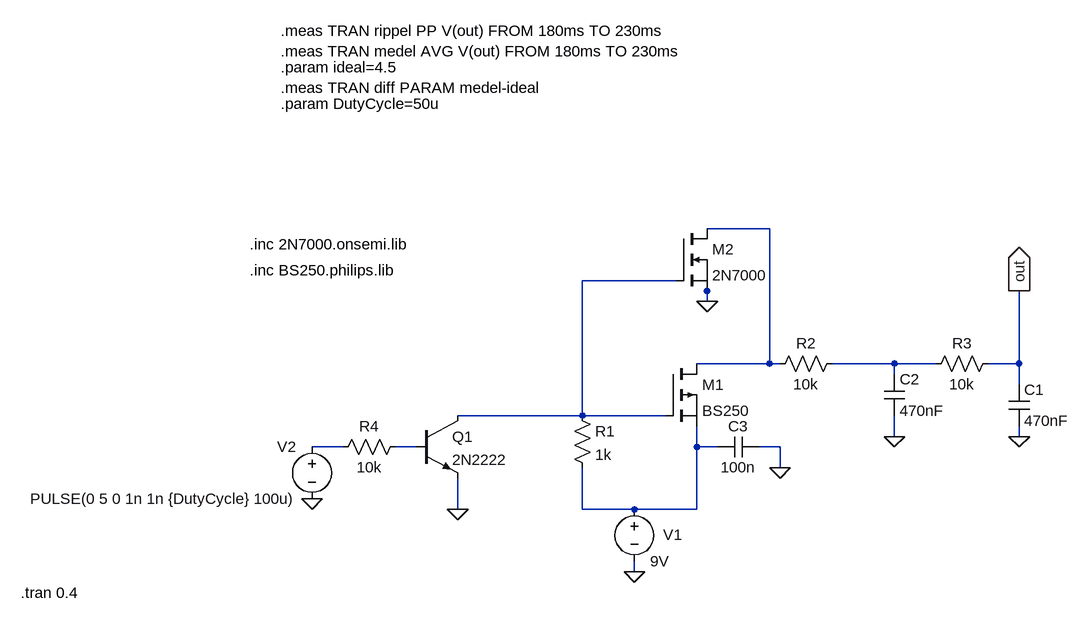
[diagram p0: schematic pwm-tuning.asc]
pwm-tuning.asc, the LTspice schematic file:
Version 4.1
SHEET 1 1088 680
WIRE 288 -128 192 -128
WIRE 144 -48 0 -48
WIRE 192 -32 192 -48
WIRE 192 -16 192 -32
WIRE 288 80 288 -128
WIRE 288 80 176 80
WIRE 304 80 288 80
WIRE 480 80 384 80
WIRE 544 80 480 80
WIRE 672 80 672 -32
WIRE 672 80 624 80
WIRE 480 96 480 80
WIRE 672 112 672 80
WIRE 0 160 0 -48
WIRE 0 160 -192 160
WIRE 128 160 0 160
WIRE 480 192 480 160
WIRE 672 192 672 176
WIRE -368 208 -416 208
WIRE -256 208 -288 208
WIRE 176 208 176 176
WIRE 208 208 176 208
WIRE 304 208 272 208
WIRE 304 240 304 208
WIRE -192 304 -192 256
WIRE 0 304 0 240
WIRE 80 304 0 304
WIRE 176 304 176 208
WIRE 176 304 80 304
WIRE 80 400 80 384
FLAG -416 288 0
FLAG 672 192 0
FLAG -192 304 0
FLAG 80 400 0
FLAG 192 -16 0
FLAG 480 192 0
FLAG 672 -32 out
IOPIN 672 -32 Out
FLAG 304 240 0
SYMBOL pmos 128 80 R0
SYMATTR InstName M1
SYMATTR Value BS250
SYMATTR Prefix X
SYMBOL npn -256 160 R0
SYMATTR InstName Q1
SYMATTR Value 2N2222
SYMBOL res -16 144 R0
SYMATTR InstName R1
SYMATTR Value 1k
SYMBOL voltage 80 288 R0
WINDOW 0 44 55 Left 2
WINDOW 123 0 0 Left 0
WINDOW 39 0 0 Left 0
SYMATTR InstName V1
SYMATTR Value 9V
SYMBOL voltage -416 192 M0
WINDOW 123 0 0 Left 0
WINDOW 39 0 0 Left 0
SYMATTR InstName V2
SYMATTR Value PULSE(0 5 0 1n 1n {DutyCycle} 100u)
SYMBOL res 400 64 R90
WINDOW 0 0 56 VBottom 2
WINDOW 3 32 56 VTop 2
SYMATTR InstName R2
SYMATTR Value 10k
SYMBOL cap 656 112 R0
SYMATTR InstName C1
SYMATTR Value 470nF
SYMBOL res -272 192 R90
WINDOW 0 0 56 VBottom 2
WINDOW 3 32 56 VTop 2
SYMATTR InstName R4
SYMATTR Value 10k
SYMBOL nmos 144 -128 R0
SYMATTR InstName M2
SYMATTR Value 2N7000
SYMATTR Prefix X
SYMBOL cap 464 96 R0
SYMATTR InstName C2
SYMATTR Value 470nF
SYMBOL res 640 64 R90
WINDOW 0 0 56 VBottom 2
WINDOW 3 32 56 VTop 2
SYMATTR InstName R3
SYMATTR Value 10k
SYMBOL cap 272 192 R90
WINDOW 0 0 32 VBottom 2
WINDOW 3 32 32 VTop 2
SYMATTR InstName C3
SYMATTR Value 100n
TEXT -864 432 Left 2 !.tran 0.4
TEXT -512 -104 Left 2 !.inc 2N7000.onsemi.lib
TEXT -512 -64 Left 2 !.inc BS250.philips.lib
TEXT -464 -432 Left 2 !.meas TRAN rippel PP V(out) FROM 180ms TO 230ms\n.meas TRAN medel AVG V(out) FROM 180ms TO 230ms
TEXT -464 -376 Left 2 !.param ideal=4.5\n.meas TRAN diff PARAM medel-ideal
TEXT -464 -320 Left 2 !.param DutyCycle=50u

The netlist it stands for:
* pwm-tuning.asc
X§M1 N001 N002 N006 BS250  ; pins D G S
Q1 N002 N005 0 0 2N2222
R1 N002 N006 1k
V1 N006 0 9V
V2 N004 0 PULSE(0 5 0 1n 1n {DutyCycle} 100u)
R2 N003 N001 10k
C1 out 0 470nF
R4 N005 N004 10k
X§M2 N001 N002 0 2N7000  ; pins D G S
C2 N003 0 470nF
R3 out N003 10k
C3 0 N006 100n
.model NPN NPN
.model PNP PNP
.lib standard.bjt
.tran 0.4
.inc 2N7000.onsemi.lib
.inc BS250.philips.lib
.meas TRAN rippel PP V(out) FROM 180ms TO 230ms
.meas TRAN medel AVG V(out) FROM 180ms TO 230ms
.param ideal=4.5
.meas TRAN diff PARAM medel-ideal
.param DutyCycle=50u
.backanno
.end